# Altium schematic sheet SCH_AP-Controller_Sheet_1_Altium.schdoc
size 296 x 211 mm
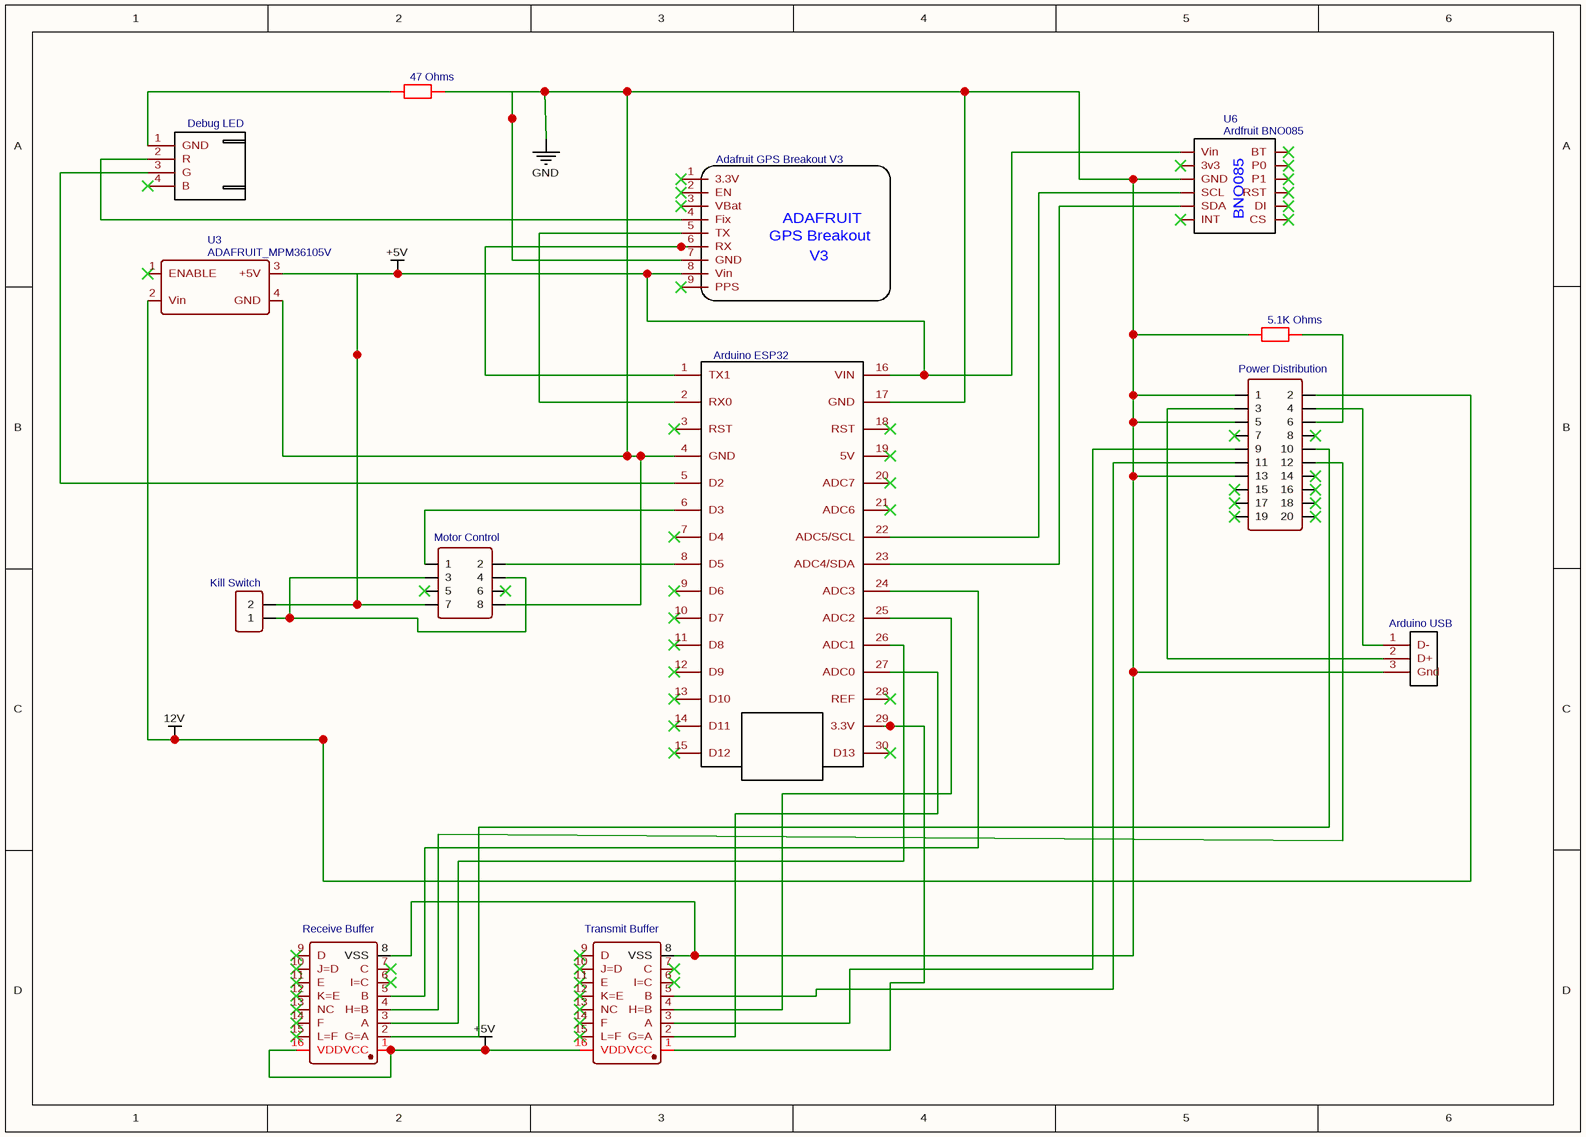
[diagram p0: SCH_AP-Controller_Sheet_1_Altium.schdoc]

## Parts
HDR-M-2.54_2X4  Motor Control  [HDR-M-2.54_2X4]
JST-XH-4-PIN  Debug LED  [JST XH 1X4]
JST_XH2.54_2P  Kill Switch  [2PIN_2.54_MM_JST_XHP_JST_CONNECTOR_FOR_DC_SOCKET]
JST_XH_1X3  Arduino USB  [JST XH 1X3]
POWER1  Power Distribution  [HDR-M-2.54_2X10]
R1  47 Ohms  [2W RESITOR]
R2  5.1K Ohms  [2W RESITOR]
U1  Arduino ESP32  [ADUINO NANO R3]
U2  Transmit Buffer  [PDIP-16_L19.3-W6.5-P2.54-LS7.6-BL]
U3  ADAFRUIT_MPM36105V  [ADAFRUIT_MPM3610_MODULE5]
U4  Adafruit GPS Breakout V3  [ADAFRUIT GPS BREAKOUT]
U5  Receive Buffer  [PDIP-16_L19.3-W6.5-P2.54-LS7.6-BL]
U6  Ardfruit BNO085  [ADAFRUIT-BNO085]

## Nets
12V: POWER1.2 U3.2(Vin)
+5V: HDR-M-2.54_2X4.7 JST_XH2.54_2P.2 U1.16(VIN) U2.16(VDD) U3.3(+5V) U4.8(Vin) U5.1(VCC) U5.16(VDD) U6.1(Vin)
GND: HDR-M-2.54_2X4.8 JST_XH_1X3.3(Gnd) POWER1.1 POWER1.5 POWER1.13 R1.2 R2.1 U1.4(GND) U1.17(GND) U2.8(VSS) U3.4(GND) U4.7(GND) U5.8(VSS) U6.3(GND)
NetHDR-M-2.54_2X4_1: HDR-M-2.54_2X4.1 U1.6(D3)
NetHDR-M-2.54_2X4_2: HDR-M-2.54_2X4.2 U1.8(D5)
NetHDR-M-2.54_2X4_3: HDR-M-2.54_2X4.3 HDR-M-2.54_2X4.4 JST_XH2.54_2P.1
NetJST-XH-4-PIN_1: JST-XH-4-PIN.1(GND) R1.1
NetJST-XH-4-PIN_2: JST-XH-4-PIN.2(R) U4.4(Fix)
NetJST-XH-4-PIN_3: JST-XH-4-PIN.3(G) U1.5(D2)
NetJST_XH_1X3_1: JST_XH_1X3.1(D-) POWER1.4
NetJST_XH_1X3_2: JST_XH_1X3.2(D+) POWER1.3
NetPOWER1_6: POWER1.6 R2.2
NetPOWER1_9: POWER1.9 U2.3(A)
NetPOWER1_10: POWER1.10 U5.2(G=A)
NetPOWER1_11: POWER1.11 U2.5(B)
NetPOWER1_12: POWER1.12 U5.4(H=B)
NetU1_1: U1.1(TX1) U4.6(RX)
NetU1_2: U1.2(RX0) U4.5(TX)
NetU1_22: U1.22(ADC5/SCL) U6.4(SCL)
NetU1_23: U1.23(ADC4/SDA) U6.5(SDA)
NetU1_24: U1.24(ADC3) U5.5(B)
NetU1_25: U1.25(ADC2) U2.4(H=B)
NetU1_26: U1.26(ADC1) U5.3(A)
NetU1_27: U1.27(ADC0) U2.2(G=A)
NetU1_29: U1.29(3.3V) U2.1(VCC)

Not connected (* = marked no-connect by the designer): HDR-M-2.54_2X4 5* 6*; JST-XH-4-PIN 4(B)*; POWER1 7* 8* 14* 15* 16* 17* 18* 19* 20*; U1 3(RST)* 7(D4)* 9(D6)* 10(D7)* 11(D8)* 12(D9)* 13(D10)* 14(D11)* 15(D12)* 18(RST)* 19(5V)* 20(ADC7)* 21(ADC6)* 28(REF)* 30(D13)*; U2 6(I=C)* 7(C)* 9(D)* 10(J=D)* 11(E)* 12(K=E)* 13(NC)* 14(F)* 15(L=F)*; U3 1(ENABLE)*; U4 1(3.3V)* 2(EN)* 3(VBat)* 9(PPS)*; U5 6(I=C)* 7(C)* 9(D)* 10(J=D)* 11(E)* 12(K=E)* 13(NC)* 14(F)* 15(L=F)*; U6 2(3v3)* 6(INT)* 7(CS)* 8(DI)* 9(RST)* 10(P1)* 11(P0)* 12(BT)*

## Notes on the sheet
- (in symbol Adafruit GPS Breakout V3) ADAFRUIT; GPS Breakout; V3
- (in symbol Ardfruit BNO085) BNO085

## Library data of the parts
HDR-M-2.54_2X4 = Motor Control: Contributor: LCEDA_Lib; Supplier Part: C58363; Supplier: LCSC; spicePre: J; spiceSymbolName: HDR-M-2.54_2x4
JST-XH-4-PIN = Debug LED: Contributor: loyboy; spicePre: U; spiceSymbolName: JST-XH-4-Pin
JST_XH2.54_2P = Kill Switch: Manufacturer Part: JST_XH2.54_2P; Contributor: Андрей Скиффи; spicePre: J; spiceSymbolName: JST_XH2.54_2P
JST_XH_1X3 = Arduino USB: Contributor: GeMeMe; spicePre: U; spiceSymbolName: JST XH 1x3
POWER1 = Power Distribution: Contributor: LCEDA_Lib; Package Display: No; Supplier Part: C124359; Supplier: LCSC; spicePre: J; spiceSymbolName: HDR-M-2.54_2x10
R1 = 47 Ohms: Contributor: Kagutsuchi; spicePre: R; spiceSymbolName: 1w resistor
R2 = 5.1K Ohms: Contributor: Kagutsuchi; spicePre: R; spiceSymbolName: 1w resistor
U1 = Arduino ESP32: Contributor: Nikolay Yanev; spicePre: U; spiceSymbolName: ARDUINO_NANO_R3
U2 = Transmit Buffer: Manufacturer: TI(德州仪器); Manufacturer Part: CD4010BE; Contributor: LCSC; Supplier: LCSC; Supplier Part: C2864860; JLCPCB Part Class: Extended Part; spicePre: U; spiceSymbolName: CD4010BE
U3 = ADAFRUIT_MPM36105V: Contributor: Aidan Farley; Supplier: Digi-Key; JLCPCB Part Class: Extended Part; spicePre: U; spiceSymbolName: ADAFRUIT_MPM36105V
U4 = Adafruit GPS Breakout V3: Manufacturer Part: New SchematicLib; Contributor: NiklasC; Supplier Part: 746; Supplier: Adafruit; link: https://www.adafruit.com/product/746; spicePre: U; spiceSymbolName: Adafruit GPS Breakout V3
U5 = Receive Buffer: Manufacturer: TI(德州仪器); Manufacturer Part: CD4010BE; Contributor: LCSC; Supplier: LCSC; Supplier Part: C2864860; JLCPCB Part Class: Extended Part; spicePre: U; spiceSymbolName: CD4010BE
U6 = Ardfruit BNO085: Contributor: Ashok Dhaker; Manufacturer: Ardfruit; spicePre: U; spiceSymbolName: Ardfruit BNO085; Supplier: Adafruit